# EAGLE schematic electric_scheme (EAGLE 9.6.2)
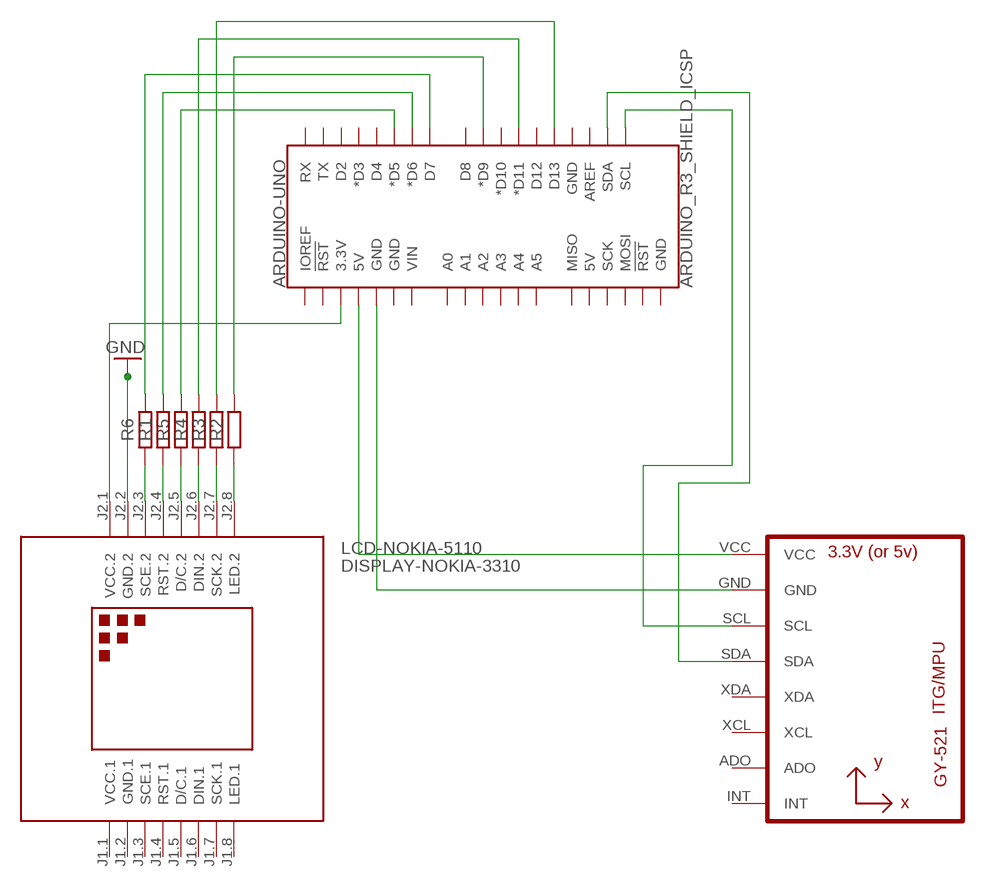
[diagram p0: schematic, sheet 1]

## Parts
ARDUINO-UNO  ARDUINO_R3_SHIELD_ICSP  [UNO_R3_SHIELD_ICSP]
LCD-NOKIA-5110  DISPLAY-NOKIA-3310  [DISPLAY-NOKIA-3310]
MPU-6500  GY-521MPU6050  [GY-521]
R1  R_AXIAL-11.7MM-PITCH  [RESAD1176W63L850D250B]
R2  R_AXIAL-11.7MM-PITCH  [RESAD1176W63L850D250B]
R3  R_AXIAL-11.7MM-PITCH  [RESAD1176W63L850D250B]
R4  R_AXIAL-11.7MM-PITCH  [RESAD1176W63L850D250B]
R5  R_AXIAL-11.7MM-PITCH  [RESAD1176W63L850D250B]
R6  R_AXIAL-11.7MM-PITCH  [RESAD1176W63L850D250B]

## Nets
N$1: ARDUINO-UNO.5V MPU-6500.VCC
N$2: ARDUINO-UNO.GND@0(GND) MPU-6500.GND
N$3: ARDUINO-UNO.SCL MPU-6500.SCL
N$4: ARDUINO-UNO.SDA MPU-6500.SDA
N$5: LCD-NOKIA-5110.J2.8(LED.2) R2.1
N$6: LCD-NOKIA-5110.J2.7(SCK.2) R3.1
N$7: LCD-NOKIA-5110.J2.6(DIN.2) R4.1
N$8: LCD-NOKIA-5110.J2.5(D/C.2) R5.1
N$9: LCD-NOKIA-5110.J2.4(RST.2) R1.1
N$10: LCD-NOKIA-5110.J2.3(SCE.2) R6.1
N$11: ARDUINO-UNO.3.3V LCD-NOKIA-5110.J2.1(VCC.2)
N$12: LCD-NOKIA-5110.J2.2(GND.2) ; supply symbol labelled GND
N$13: ARDUINO-UNO.D5(*D5) R5.2
N$14: ARDUINO-UNO.D6(*D6) R1.2
N$15: ARDUINO-UNO.D7 R6.2
N$16: ARDUINO-UNO.D9(*D9) R2.2
N$17: ARDUINO-UNO.D11(*D11) R4.2
N$18: ARDUINO-UNO.D13 R3.2
Unconnected: ARDUINO-UNO.5V_ICSP(5V) ARDUINO-UNO.A0 ARDUINO-UNO.A1 ARDUINO-UNO.A2 ARDUINO-UNO.A3 ARDUINO-UNO.A4 ARDUINO-UNO.A5 ARDUINO-UNO.AREF ARDUINO-UNO.D2 ARDUINO-UNO.D3(*D3) ARDUINO-UNO.D4 ARDUINO-UNO.D8 ARDUINO-UNO.D10(*D10) ARDUINO-UNO.D12 ARDUINO-UNO.GND@1(GND) ARDUINO-UNO.GND@2(GND) ARDUINO-UNO.GND_ICSP(GND) ARDUINO-UNO.IOREF ARDUINO-UNO.MISO ARDUINO-UNO.MOSI ARDUINO-UNO.RES(!RST!) ARDUINO-UNO.RST_ICSP(!RST!) ARDUINO-UNO.RX ARDUINO-UNO.SCK ARDUINO-UNO.TX ARDUINO-UNO.VIN LCD-NOKIA-5110.J1.3(SCE.1) LCD-NOKIA-5110.J1.4(RST.1) LCD-NOKIA-5110.J1.5(D/C.1) LCD-NOKIA-5110.J1.6(DIN.1) LCD-NOKIA-5110.J1.7(SCK.1) LCD-NOKIA-5110.J1.8(LED.1) MPU-6500.ADO MPU-6500.INT MPU-6500.XCL MPU-6500.XDA

## Power pins joined to a net without a drawn wire
GND.1: LCD-NOKIA-5110.J1.2(GND.1)
VCC.1: LCD-NOKIA-5110.J1.1(VCC.1)

## Library data of the parts
ARDUINO-UNO = Arduino-Uno-Mega:ARDUINO_R3_SHIELD_ICSP: Arduino R3 Shield Footprint w/ 6-pin (2x3) ICSP Header
LCD-NOKIA-5110 = diy-modules:DISPLAY-NOKIA-3310: 84x48 Dot Matrix LCD Module based on Nokia 3310 display More details available here: https://arduinoandsoftware.wordpress.com/2012/12/30/nokia-33105110-3-3v-display-with-5v-arduino/
MPU-6500 = gy-521:GY-521
R1-R6 = Resistor:R: Resistor Fixed - Generic; CATEGORY: Resistor; SUB-CATEGORY: Fixed